# Altium schematic sheet MAIN.SchDoc
size A4; SheetNumber: 1; SheetTotal: 1; ENG_APP_DATE: --/--/--; DSN_APP_DATE: --/--/--; CHK_APP_DATE: --/--/--
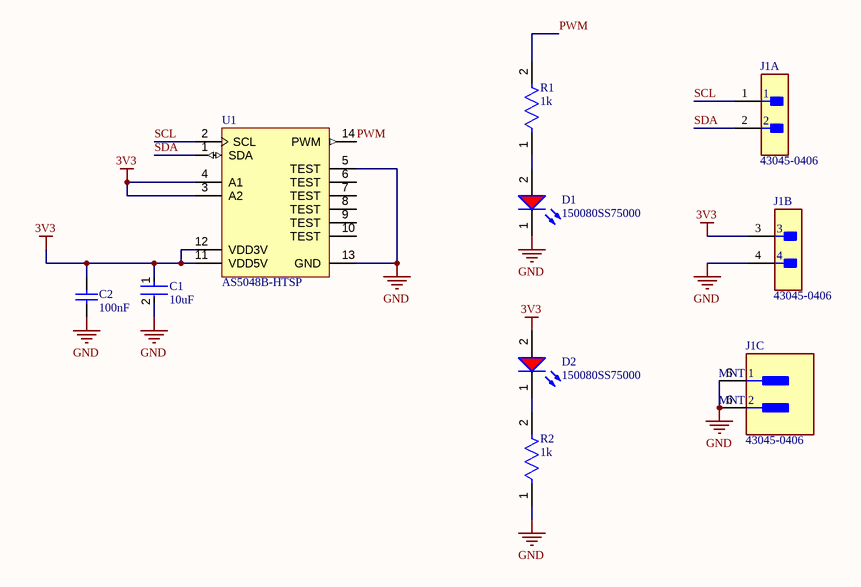
[diagram p0: MAIN.SchDoc]

## Parts
C1  10uF  [FP-GRM188-0_1-e0_2_0_55-IPC_A]
C2  100nF  [CAPC2013X140X50ML20T25]
D1  150080SS75000  [WL-SMCW_0805_150080xx75000]
D2  150080SS75000  [WL-SMCW_0805_150080xx75000]
J1  43045-0406  [FP-43045-0406-MFG]  (parts A,B,C of 3)
R1  1k  [FP-RC0603-0_55-IPC_A]
R2  1k  [FP-RC0603-0_55-IPC_A]
U1  AS5048B-HTSP  [AMS-TSSOP-14-5000X4400DE_L]

## Nets
3V3: C1.1 C2.2 D2.2(A) J1.3 U1.3(A2) U1.4(A1) U1.11(VDD5V) U1.12(VDD3V)
GND: C1.2 C2.1 D1.1(K) J1.4 J1.5(MNT_1) J1.6(MNT_2) R2.1 U1.5(TEST) U1.13(GND)
PWM: R1.2 U1.14(PWM)
SCL: J1.1 U1.2(SCL)
SDA: J1.2 U1.1(SDA)
NetD1_2: D1.2(A) R1.1
NetD2_1: D2.1(K) R2.2

Not connected (* = marked no-connect by the designer): U1 6(TEST) 7(TEST) 8(TEST) 9(TEST) 10(TEST)

## Notes on the sheet
- DWG. NO.
- REV.
- SHT.
- THIS DOCUMENT AND THE DATA DISCLOSED HEREIN OR HEREWITH IS THE PROPERTY OF ALTIUM LIMITED AND MAY BE FREELY DISTRIBUTED IN WHOLE. NO RIGHTS ARE RESERVED OR EXPRESS OR IMPLIED WARANTEE GIVEN.
- REVISION
- DESCRIPTION
- DATE
- APPROVED
- ENG:
- APPROVALS
- PROJECT
- DSN:
- CHK:
- REFERENCE DOCUMENTS
- PROJECT REVISION:
- TITLE
- DOCUMENT REVISION:
- DESIGN ITEM:
- BOM:
- FAB DWG:
- PCB DWG:
- ASSY DWG:
- SCALE:
- SIZE
- B
- CAGE CODE
- FILE NAME
- DWG NO.
- SHEET
- OF
- REV

## Library data of the parts
C1 = CMP-2006-02792-2: Chip Multilayer Ceramic Capacitors for General Purpose, 0603, 10uF, X5R, 15%, 20%, 6.3V; Packaging: Tape and Reel; Voltage Rating (DC): 6.3V; Width: 0.031inch; Termination: SMD/SMT; Dielectric: X5R; Package Quantity: 4000; Voltage Rating: 6.3V; Capacitance: 10uF; Case/Package: 0603; Min Operating Temperature: -55°C; Voltage: 6.3V; Length: 1.6mm; Thickness: 0.035inch; Lead Free: Lead Free; Depth: 0.8mm; Case Code (Imperial): 0603; Max Operating Temperature: 85°C; Material: Ceramic; Height: 0.8mm; Tolerance: 20%; Mount: Surface Mount; REACH SVHC: No SVHC; Radiation Hardening: No; Case Code (Metric): 1608
C2 = CMP-2007-04784-1: Manufacturer: AVX Interconnect / Elco; Part Number: 08055F104KAT2A
D1 D2 = CMP-1426-00010-4: Led, Red, 630 Nm, 1.9 V, 30 Ma, 60 Mcd Rohs Compliant: Yes; Reverse Voltage: 5V; Test Current: 20mA; Forward Current: 100mA; Power Dissipation: 72mW; Peak Wavelength: 645nm; Lens Style: Clear, Rectangular; Viewing Angle: 140°; Forward Voltage: 1.9V; Luminous Intensity: 60mcd; Wavelength: 630nm; Max Junction Temperature (Tj): 95°C; Color: Red; Case/Package: 0805; Length: 2mm; RoHS: Compliant; Max Operating Temperature: 85°C; Min Operating Temperature: -40°C; Case Code (Metric): 2012; Case Code (Imperial): 0805; Dominant Wavelength: 630nm; Max Reverse Voltage (DC): 5V; REACH SVHC: Unknown; Packaging: Tape and Reel; Mount: Surface Mount; Width: 1.25mm; Height: 700µm
J1 = CMP-04776-000244-1: CONN HEADER SMD R/A 4POS 3MM; Max Voltage Rating (DC): 250.25kV; Contact Resistance: 10mR; Glow Wire Compliant: Compliant; Current Rating: 5A; Number of Contacts: 4; Gender: Male; Voltage Rating: 600V; Voltage Rating (DC): 250V; Min Operating Temperature: -40°C; Mount: Surface Mount; Contact Material: Brass; Number of Rows: 2; Flammability Rating: UL94 V-0; Series: Micro-Fit 3.0; Termination: SMD/SMT; Packaging: Tape and Reel; Row Spacing: 3mm; Contact Plating: Tin; Case/Package: 0406; Package Quantity: 1800; Number of Circuits: 4; Halogen Free: Low Halogen; Pitch: 3mm; Max Operating Temperature: 105°C; RoHS Compliant: Yes; Housing Material: Thermoplastic; Color: Black; Number of Positions: 4; Orientation: Right Angle
R1 R2 = CMP-1659-00009-5: RES 1K OHM 1% 1/10W 0603; Resistance: 1kR; Voltage Rating: 50V; Power Rating: 100mW; Temperature Coefficient: 100ppm/°C; Military Standard: Not; REACH SVHC: No SVHC; Size Code: 0603; Features: Moisture Resistant; Number of Terminations: 2; Technology: THICK FILM; Series: RC; Case Code (Metric): 1608; Resistance Tolerance: 1%; Resistor Type: Thick Film; Termination: SMD/SMT; Contact Plating: Tin; Radiation Hardening: No; Min Operating Temperature: -55°C; Max Operating Temperature: 155°C; Packaging: Tape and Reel; Max Power Dissipation: 100mW; RoHS Compliant: Yes; Height: 0.45mm; Lead Free: Lead Free; Case/Package: 0603; Length: 1.6mm; Tolerance: 1%; Case Code (Imperial): 0603; Construction: Rectangular; Depth: 0.8mm
U1 = CMP-0555-00031-2: Magnetic Rotary Encoder 14-bit Angular Position Sensor, 3.3 or 5 V, TSSOP-14, Pb-Free, Reel; Manufacturer: AMS; Supply Voltage (V): 3.3 or 5.0; Output: IÂ²C, PWM; PackageDescription: 14-Pin Small Outline Package, 5 x 4.4 mm Body, 0.65 mm Pitch; Mounting Technology: Surface Mount; ComponentLink2URL: http://www.ams.com/eng/content/download/438523/1341157/143016; ComponentLink2Description: Datasheet; PackageReference: TSSOP-14; Features: IÂ²C, PWM, In System Programmable; PackageVersion: Rev. 2.7, 10/2010; Code_JEDEC: MO-153; DatasheetVersion: Rev. 1.3; Resolution: 14-bit; PartNumber: AS5048B-HTSP; ComponentLink1Description: Manufacturer URL; ComponentLink1URL: www.ams.com